# Altium schematic sheet CAN_1.SchDoc: foxBMS BMS-Extension
size A3; DocumentNumber: 8; SheetNumber: 8; SheetTotal: 14; Author: Fraunhofer IISB foxBMS Team; REL-DATE: 2017-05-16; VERSION: 1.0.2; GateName_1: G$1; SymbolName_1: FRAME_B_L; LibraryName: foxBMS_BMS-Master_V1.00_A; DeviceSetName: FRAME_B_L; GateName_2: G$2; SymbolName_2: DOCFIELD; SheetDescription: CAN Interface 1
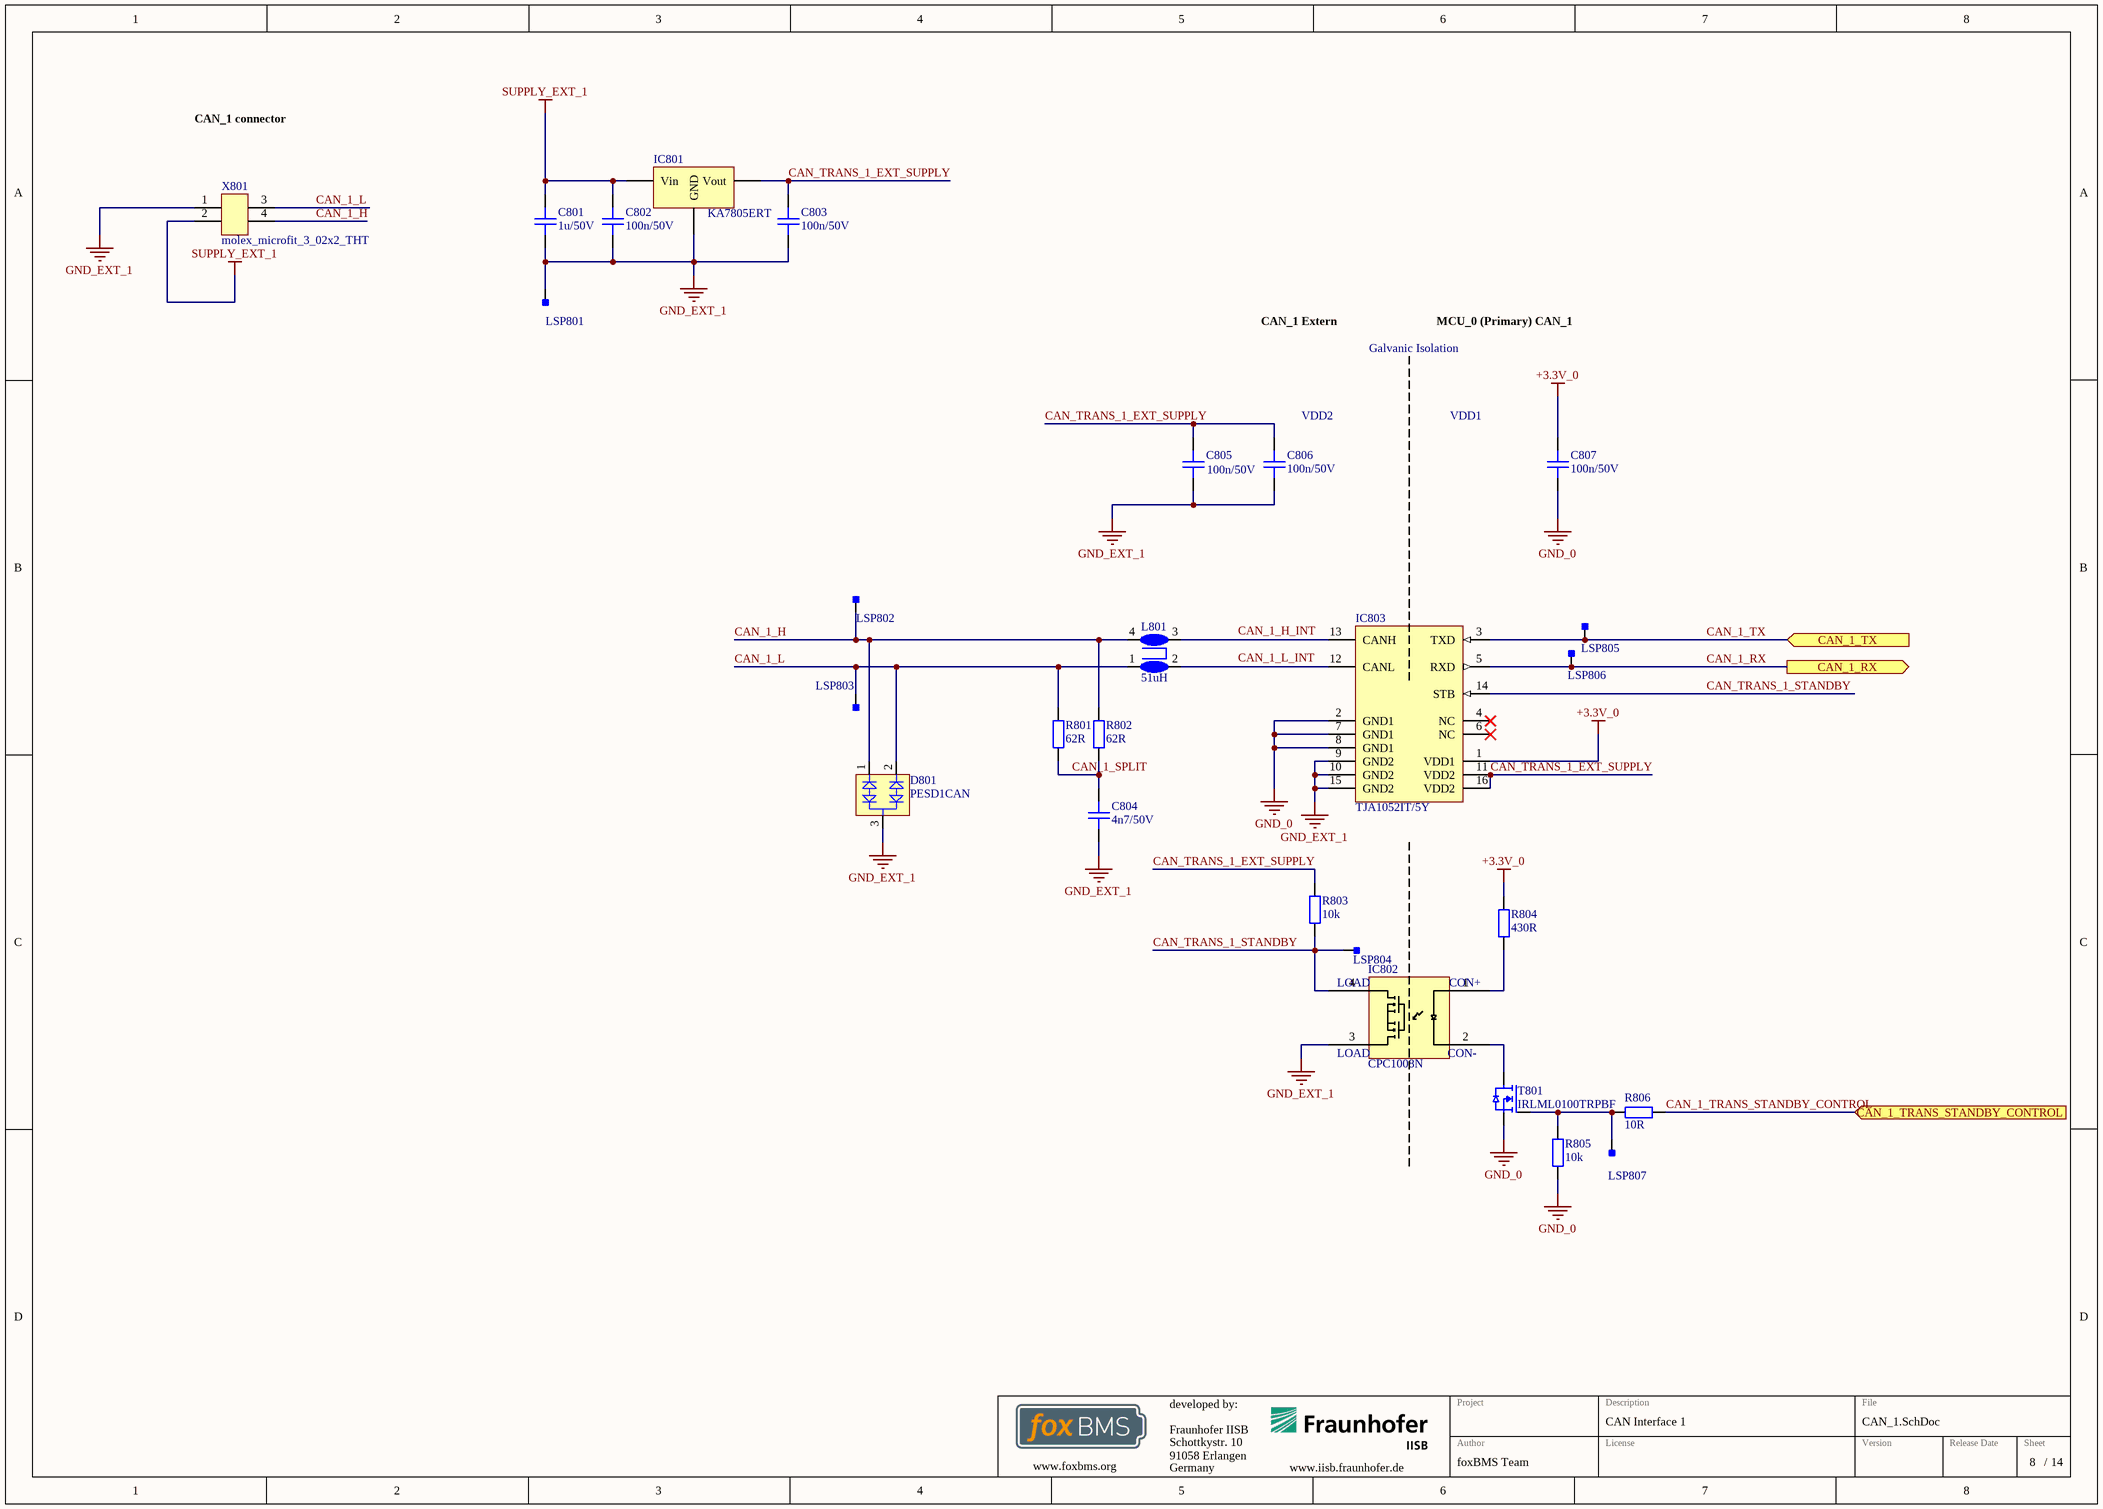
[diagram p0: CAN_1.SchDoc]

## Parts
C801  1u/50V  [CAPC1608X08N]
C802  100n/50V  [CAPC1608X08N]
C803  100n/50V  [CAPC1608X08N]
C804  4n7/50V  [CAPC1608X08N]
C805  100n/50V  [CAPC1608X08N]
C806  100n/50V  [CAPC1608X08N]
C807  100n/50V  [CAPC1608X08N]
D801  PESD1CAN  [NXP-SOT23-3_V]
IC801  KA7805ERT  [DPAK228P950X240-3N]
IC802  CPC1008N  [SOP254P610X218-4N]
IC803  TJA1052IT/5Y  [NXP-SOIC-16_L]
L801  51uH  [B82789C0/S0]
LSP801  Testpoint_Square  [Testpoint_S1]  (value not drawn)  (no BOM)
LSP802  Testpoint_Square  [Testpoint_S1]  (value not drawn)  (no BOM)
LSP803  Testpoint_Square  [Testpoint_S1]  (value not drawn)  (no BOM)
LSP804  Testpoint_Square  [Testpoint_S1]  (value not drawn)  (no BOM)
LSP805  Testpoint_Square  [Testpoint_S1]  (value not drawn)  (no BOM)
LSP806  Testpoint_Square  [Testpoint_S1]  (value not drawn)  (no BOM)
LSP807  Testpoint_Square  [Testpoint_S1]  (value not drawn)  (no BOM)
R801  62R  [RESC1608X05N]
R802  62R  [RESC1608X05N]
R803  10k  [RESC1608X05N]
R804  430R  [RESC1608X05N]
R805  10k  [RESC1608X05N]
R806  10R  [RESC1608X05N]
T801  IRLML0100TRPBF  [SOT95P237X110-3N]
X801  molex_microfit_3_02x2_THT  [MOLEX_MICROFIT_02x2_THT]

## Ports
CAN_1_RX (out), CAN_1_TRANS_STANDBY_CONTROL (in), CAN_1_TX (in)

## Nets
+3.3V_0: C807.2 IC803.1(VDD1) R804.1
GND_0: C807.1 IC803.2(GND1) IC803.7(GND1) IC803.8(GND1) R805.2 T801.S
GND_EXT_1: C801.1 C802.1 C803.1 C804.2 C805.1 C806.1 D801.3(C) IC801.2(GND) IC802.3 IC803.9(GND2) IC803.10(GND2) IC803.15(GND2) LSP801.1 X801.1
SUPPLY_EXT_1: C801.2 C802.2 IC801.1(Vin) X801.2
CAN_1_H: D801.1(K1) L801.4 LSP802.1 R802.2 X801.4
CAN_1_L: D801.2(K2) L801.1 LSP803.1 R801.1 X801.3
CAN_1_RX: IC803.5(RXD) LSP806.1 ; port CAN_1_RX
CAN_1_SPLIT: C804.1 R801.2 R802.1
CAN_1_TRANS_STANDBY_CONTROL: R806.2 ; port CAN_1_TRANS_STANDBY_CONTROL
CAN_1_TX: IC803.3(TXD) LSP805.1 ; port CAN_1_TX
CAN_TRANS_1_EXT_SUPPLY: C803.2 C805.2 C806.2 IC801.3(Vout) IC803.11(VDD2) IC803.16(VDD2) R803.1
CAN_TRANS_1_STANDBY: IC802.4 IC803.14(STB) LSP804.1 R803.2
NetIC802_1: IC802.1 R804.2
NetIC802_2: IC802.2 T801.D
NetIC803_12: IC803.12(CANL) L801.2
NetIC803_13: IC803.13(CANH) L801.3
NetLSP807_1: LSP807.1 R805.1 R806.1 T801.G

Not connected (* = marked no-connect by the designer): IC803 4(NC)* 6(NC)*

## Notes on the sheet
- CAN_1 connector
- CAN_1 Extern
- Galvanic Isolation
- MCU_0 (Primary) CAN_1
- (near C806) VDD2
- VDD1
- Labels drawn without touching a wire or pin: CAN_1_H_INT, CAN_1_L_INT
- Fraunhofer IISB
- Schottkystr. 10
- developed by:
- 91058 Erlangen
- Germany
- Author
- Project
- License
- Description
- File
- Version
- Release Date
- Sheet
- www.foxbms.org
- www.iisb.fraunhofer.de
- foxBMS Team
- /
- (in symbol CPC1008N) LOAD; CON+; CON-

## Library data of the parts
C801 = gen_C_ceramic_1u_50V_X7R_0603: MLCC; Capacitance: 1u; Rated Voltage: 50V; Dielectric: X7R; Case EIA: 0603; Case Metric: 1608; Tolerance: ± 10%; Part Number: gen_C_ceramic_1u_50V_X7R_0603; Operating Temperature: -55°C - +125°C; Supplier 1: Farnell; Supplier Part Number 1: 2779055
C802 C803 C805-C807 = gen_C_ceramic_100n_50V_X7R_0603: MLCC; Capacitance: 100n; Rated Voltage: 50V; Dielectric: X7R; Case EIA: 0603; Case Metric: 1608; PnP Package: C_0603_10; PnP Value: 100n/50V/X7R; PnP equipped: x; Part Number: gen_C_ceramic_100n_50V_X7R_0603; Supplier 1: Farnell; Supplier Part Number 1: 2525267
C804 = gen_C_ceramic_4n7_50V_X7R_0603: MLCC; Capacitance: 4n7; Rated Voltage: 50V; Dielectric: X7R; Case EIA: 0603; Case Metric: 1608; PnP Package: C_0603_05; Automotive Qualified: True; Part Number: gen_C_ceramic_4n7_50V_X7R_0603; Supplier 1: Farnell; Supplier Part Number 1: 2904754
D801 = CMP-2000-04916-1: CAN Bus ESD Protection Diode, 200 W, 24 V, -65 to 150 degC, 3-Pin SOT23, RoHS, Tape and Reel; Manufacturer: NXP Semiconductors; SVHC: NoSVHC(20-Jun-2013); Reverse Stand-Off Voltage Vrwm: 24V; Breakdown Voltage Max: 30.3V; Capacitance Cd @ Vr Typ: 11pF; TVS Polarity: Bidirectional; Peak Pulse Power: 200W; Breakdown Voltage Min: 25.4V; Clamping Voltage @ 8/20µs Max: 70V; Peak Pulse Current Ippm: 3A; SMD Marking: AN; Diode Case Style: SOT-23; Breakdown Voltage: 27.8V; Breakdown Voltage Range: 25.4Vto30.3V; Capacitance Cd @ Vr Max: 17pF; No. of Pins: 3; Diode Type: BidirectionalTVS; Termination Type: SMD; Operating Temperature Max: 150degC; Datasheet URL: https://datasheet.ciiva.com/22692/109497-22692467.pdf; Package / Case: SOT-23; Diode Configuration: Bidirectional; Operating Temperature Min: -65degC; Stand-off Voltage: 24V; Datasheet Version: Rev. 04, 02/2008; Manufacturer URL: http://www.nxp.com/; Operating Temperature Range: -65degCto+150degC; Breakover Voltage Min: 25.4V; Clamping Voltage Vc Max: 70V
IC801 = KA7805ERTF: 3-Terminal 1 A Positive Voltage Regulator; Manufacturer: Fairchild; Part Number: KA7805ERTF; Part Name: KA7805ERTF; Operating Temperature: -40°C - +125°C; ComponentLink1Description: Datasheet; ComponentLink1URL: http://www.farnell.com/datasheets/2299720.pdf; Supplier 1: Farnell; Supplier Part Number 1: 2102585
IC802 = CPC1008N: Single-Pole, Normally Open 4-Pin SOP OptoMOS Relay; Manufacturer: CLARE; Part Number: CPC1008N; Part Name: CPC1008N; Operating Temperature: -40°C - +85°C; ComponentLink1Description: Datasheet; ComponentLink1URL: http://www.farnell.com/datasheets/1924621.pdf; Supplier 1: Farnell; Supplier Part Number 1: 1653755
IC803 = CMP-2000-07246-1: Galvanically Isolated High-Speed CAN Transceiver, -40 to 125 degC, 16-Pin SOIC, RoHS, Tape and Reel; Manufacturer: NXPSemiconductors; Rad Hard: No; Minimum Single Supply Voltage: 3; Maximum Single Supply Voltage: 5.25V; Power Down Mode: Standby; Maximum Data Rate: 1Mbps; Standard Supported: ISO11898-2; Number of Transceivers: 1; Package Description: 16-Pin Small Outline Integrated Circuit, Body 10.3 x 7.5 mm, Pitch 1.27 mm; Package: 16SOIC; Datasheet URL: http://www.nxp.com/documents/data_sheet/TJA1052I.pdf; Category: Transceiver; Manufacturer URL: http://www.nxp.com/; Datasheet Version: Rev. 3, 01/2015; Packaging: Tape&Reel; Package Reference: SOT162-1; Mounting Technology: SurfaceMount
L801 = B82789N: Common Mode Choke; Manufacturer: EPCOS / TDK; Rated Current: 250mA; Part Number: B82789N; Operating Temperature: -55°C - +150°C; ComponentLink1Description: Datasheet; ComponentLink1URL: https://www.mouser.com/ds/2/400/b82789c0_s0-1220172.pdf; Inductance: 51uH; Supplier 1: Mouser; Supplier Part Number 1: 871-B82789C0513H002
LSP801-LSP807 = Testpoint_Square: Testpoint, square; Part Number: Testpoint_Square
R801 R802 = gen_R_62R_0603: SMD Resistor 62R 0603; Tolerance: 1%; Power: 0.1W; Case EIA: 0603; Case Metric: 1608; Maximum Working Voltage: 75V; PnP Package: R_0603; Part Number: gen_R_62R_0603; Operating Temperature: -55°C - +155°C; Resistance: 62R; Series: E24; PnP Value: 62R; Supplier 1: Farnell; Supplier Part Number 1: 2073943
R803 R805 = gen_R_10k_0603: SMD Resistor 10k 0603; Tolerance: 1%; Power: 0.1W; Case EIA: 0603; Case Metric: 1608; Maximum Working Voltage: 75V; PnP Package: R_0603; Part Number: gen_R_10k_0603; Operating Temperature: -55°C - +155°C; Resistance: 10k; Series: E24, E96; PnP Value: 10k; Supplier 1: Farnell; Supplier Part Number 1: 2073349
R804 = gen_R_430R_0603: SMD Resistor 430R 0603; Tolerance: 1%; Power: 0.1W; Case EIA: 0603; Case Metric: 1608; Maximum Working Voltage: 75V; PnP Package: R_0603; Part Number: gen_R_430R_0603; Operating Temperature: -55°C - +155°C; Resistance: 430R; Series: E24; PnP Value: 430R; Supplier 1: Farnell; Supplier Part Number 1: 2074259
R806 = gen_R_10R_0603: SMD Resistor 10R 0603; Tolerance: 1%; Power: 0.1W; Case EIA: 0603; Case Metric: 1608; Maximum Working Voltage: 75V; PnP Package: R_0603; Part Number: gen_R_10R_0603; Operating Temperature: -55°C - +155°C; Resistance: 10R; Series: E24, E96; PnP Value: 10R; Supplier 1: Farnell; Supplier Part Number 1: 2073361
T801 = IRLML0100TRPBF: MOSFET-Transistor, n-Kanal, 1.6 A, 100 V, 0.178 ohm, 10 V, 2.5 V; Manufacturer: Infineon; Maximum Drain-Source Voltage: 100V; Maximum Continous Drain Current (25°C): 1.6A; R_DS(on): 190m; Total Gate Charge: 2.5nC; Part Number: IRLML0100TRPBF; Part Name: NMOS; Operating Temperature: -55°C - +150°C; ComponentLink1Description: Datasheet URL; ComponentLink1URL: http://www.farnell.com/datasheets/491501.pdf; Supplier 1: Farnell; Supplier Part Number 1: 1783928
X801 = molex_microfit_3_02x2_THT: Micro-Fit 3.0 Right Angle Header, 3.00mm Pitch, Dual Row, 4 Circuits, with Snap-in Plastic Peg PCB Lock, Tin, Glow Wire Capable, Black, 43045-0400; Manufacturer: Molex; Circuits: 4; Rated Voltage: 600V; Rated Current: 8.5A; Part Number: molex_microfit_3_02x2_THT; Part Name: MicroFit; Operating Temperature: -40°C - +105°C; Supplier 1: Farnell; Supplier Part Number 1: 9733019